# EAGLE schematic ESP_programmer (EAGLE 8.1.1)
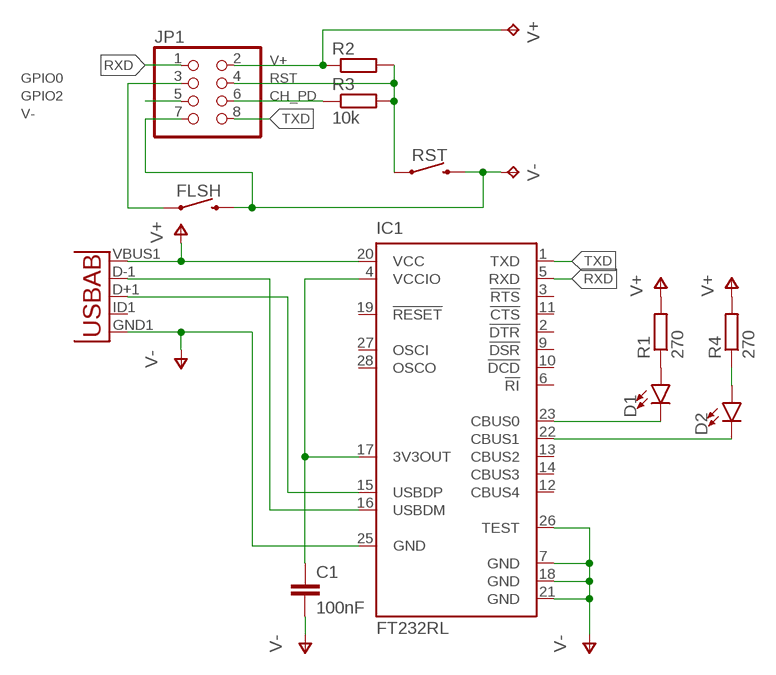
[diagram p0: schematic, sheet 1]

## Parts
C1  100nF  0.22UF-0603-25V-10%  [0603]
D1  TX  LED-BLUE0603  [LED-0603]
D2  RX  LED-BLUE0603  [LED-0603]
FLSH  MOMENTARY-SWITCH-SPST-PTH-6.0MM  [TACTILE_SWITCH_PTH_6.0MM]
IC1  FT232RL  [SSOP28]
JP1  PINHD-2X4  [2X04]
R1  270  R-EU_MELF0102R  [MINI_MELF-0102R]
R2  10k  R-EU_MELF0102R  [MINI_MELF-0102R]
R3  10k  R-EU_MELF0102R  [MINI_MELF-0102R]
R4  270  R-EU_MELF0102R  [MINI_MELF-0102R]
RST  MOMENTARY-SWITCH-SPST-PTH-6.0MM  [TACTILE_SWITCH_PTH_6.0MM]
U1  USB""  [USB-MICRO-SMD]
V+  TPB1,27  [B1,27]
V-  TPB1,27  [B1,27]

## Nets
CH_PD: JP1.6 R3.1
GPIO0: FLSH.1 JP1.3
GPIO2: JP1.5
N$1: D2.A R4.1
N$2: IC1.16(USBDM) U1.D-1(D-)
N$3: IC1.15(USBDP) U1.D+1(D+)
N$4: D1.A R1.1
N$5: C1.1 IC1.4(VCCIO) IC1.17(3V3OUT)
N$6: D1.C IC1.23(CBUS0)
N$8: D2.C IC1.22(CBUS1)
RST: JP1.4 R2.2 R3.2 RST.1
RXD: IC1.5(RXD) JP1.1
TXD: IC1.1(TXD) JP1.8
V+: IC1.20(VCC) JP1.2 R1.2 R2.1 R4.2 U1.VBUS1(USB_VCC) V+.TP
V-: C1.2 FLSH.3 IC1.7(GND) IC1.18(GND) IC1.21(GND) IC1.25(GND) IC1.26(TEST) JP1.7 RST.3 U1.GND1(USB_GND) V-.TP
Unconnected: IC1.2(!DTR) IC1.3(!RTS) IC1.6(!RI) IC1.9(!DSR) IC1.10(!DCD) IC1.11(!CTS) IC1.12(CBUS4) IC1.13(CBUS2) IC1.14(CBUS3) IC1.19(!RESET) IC1.27(OSCI) IC1.28(OSCO) U1.ID1(NC)

## Library data of the parts
C1 = SparkFun-Capacitors:0.22UF: 0.22µF ceramic capacitors A capacitor is a passive two-terminal electrical component used to store electrical energy temporarily in an electric field.; PROD_ID: CAP-07822; VALUE: 0.22uF
D1 D2 = SparkFun-LED:LED-BLUE: Blue SMD LED Used in manufacturing of various products at SparkFun Packages: 0603 - SMD 0603 package [Product Link] <http://www.digikey.com/product-detail/en/SMLE12BC7TT86/511-1589-2-ND/1641808> 1206 - SMD1206 package [Product Link] <http://www.digikey.com/product-detail/en/lite-on-inc/LTST-C150TBKT/160-1643-1-ND/573584> SparkFun Products: ESP8266 Thing-Dev Board <https://www.sparkfun.com/products/13711> RedBoard <https://www.sparkfun.com/products/12757>; PROD_ID: DIO-08575; VALUE: BLUE
FLSH RST = SparkFun-Switches:MOMENTARY-SWITCH-SPST: Momentary Switch (Pushbutton) - SPST Normally-open (NO) SPST momentary switches (buttons, pushbuttons). Variants PTH-12MM - 12mm square, through-hole Momentary Pushbutton Switch - 12mm Square <https://www.sparkfun.com/products/9190> (COM-09190) PTH-6.0MM, PTH-6.0MM-KIT - 6.0mm square, through-hole Mini Pushbutton Switch <https://www.sparkfun.com/products/97> (COM-00097) KIT package intended for soldering kit's - only one side of pads' copper is exposed. PTH-RIGHT-ANGLE-KIT - Right-angle, through-hole Right Angle Tactile Button <https://www.sparkfun.com/products/10791> - Used on SparkFun BigTime Watch Kit <https://www.sparkfun.com/products/11734> SMD-12MM - 12mm square, surface-mount Tactile Button - SMD (12mm) <https://www.sparkfun.com/products/12993> (COM-12993) Used on SparkFun PicoBoard <https://www.sparkfun.com/products/11888> SMD-4.5MM - 4.5mm Square Trackball Switch Used on SparkFun Blackberry Trackballer Breakout <https://www.sparkfun.com/products/13169> SMD-4.6MMX2.8MM - 4.60mm x 2.80mm, surface mount Used on SparkFun SAMD21 Mini Breakout <https://www.sparkfun.com/products/13664> SMD-5.2MM, SMD-5.2-REDUNDANT - 5.2mm square, surface-mount Mini Pushbutton Switch - SMD <https://www.sparkfun.com/products/8720> (COM-08720) Used on Arduino Pro Mini <https://www.sparkfun.com/products/11114> REDUNDANT package connects both switch circuits together SMD-6.0X3.5MM - 6.0 x 3.5mm, surface mount Momentary Reset Switch SMD <https://www.sparkfun.com/products/8229> (COM-08229) SMD-6.2MM-TALL - 6.2mm square, surface mount Tactile Button - SMD (6mm) <https://www.sparkfun.com/products/12992> Used on SparkFun Digital Sandbox <https://www.sparkfun.com/products/12651> SMD-RIGHT-ANGLE - Right-angle, surface mount Used on SparkFun Block for Intel® Edison - Arduino <https://www.sparkfun.com/products/13036>; PROD_ID: SWCH-08441; SF_SKU: COM-00097
IC1 = ftdichip:FT232R: Source: http://www.ftdichip.com/Documents/DataSheets/DS_FT232R_v104.pdf; MPN: FT232RL; OC_FARNELL: 1146032; OC_NEWARK: 91K9918
JP1 = FPAA_pinhead:PINHD-2X4: PIN HEADER
R1-R4 = resistor:R-EU_: RESISTOR, European symbol
U1 = USB_micro:USB: This is a USB AB connector that is compatible with USB OTG. i.e. this connector can serve as a host or device
V+ V- = testpad:TP: Test pad